# EAGLE design shield (EAGLE 7.5.0)
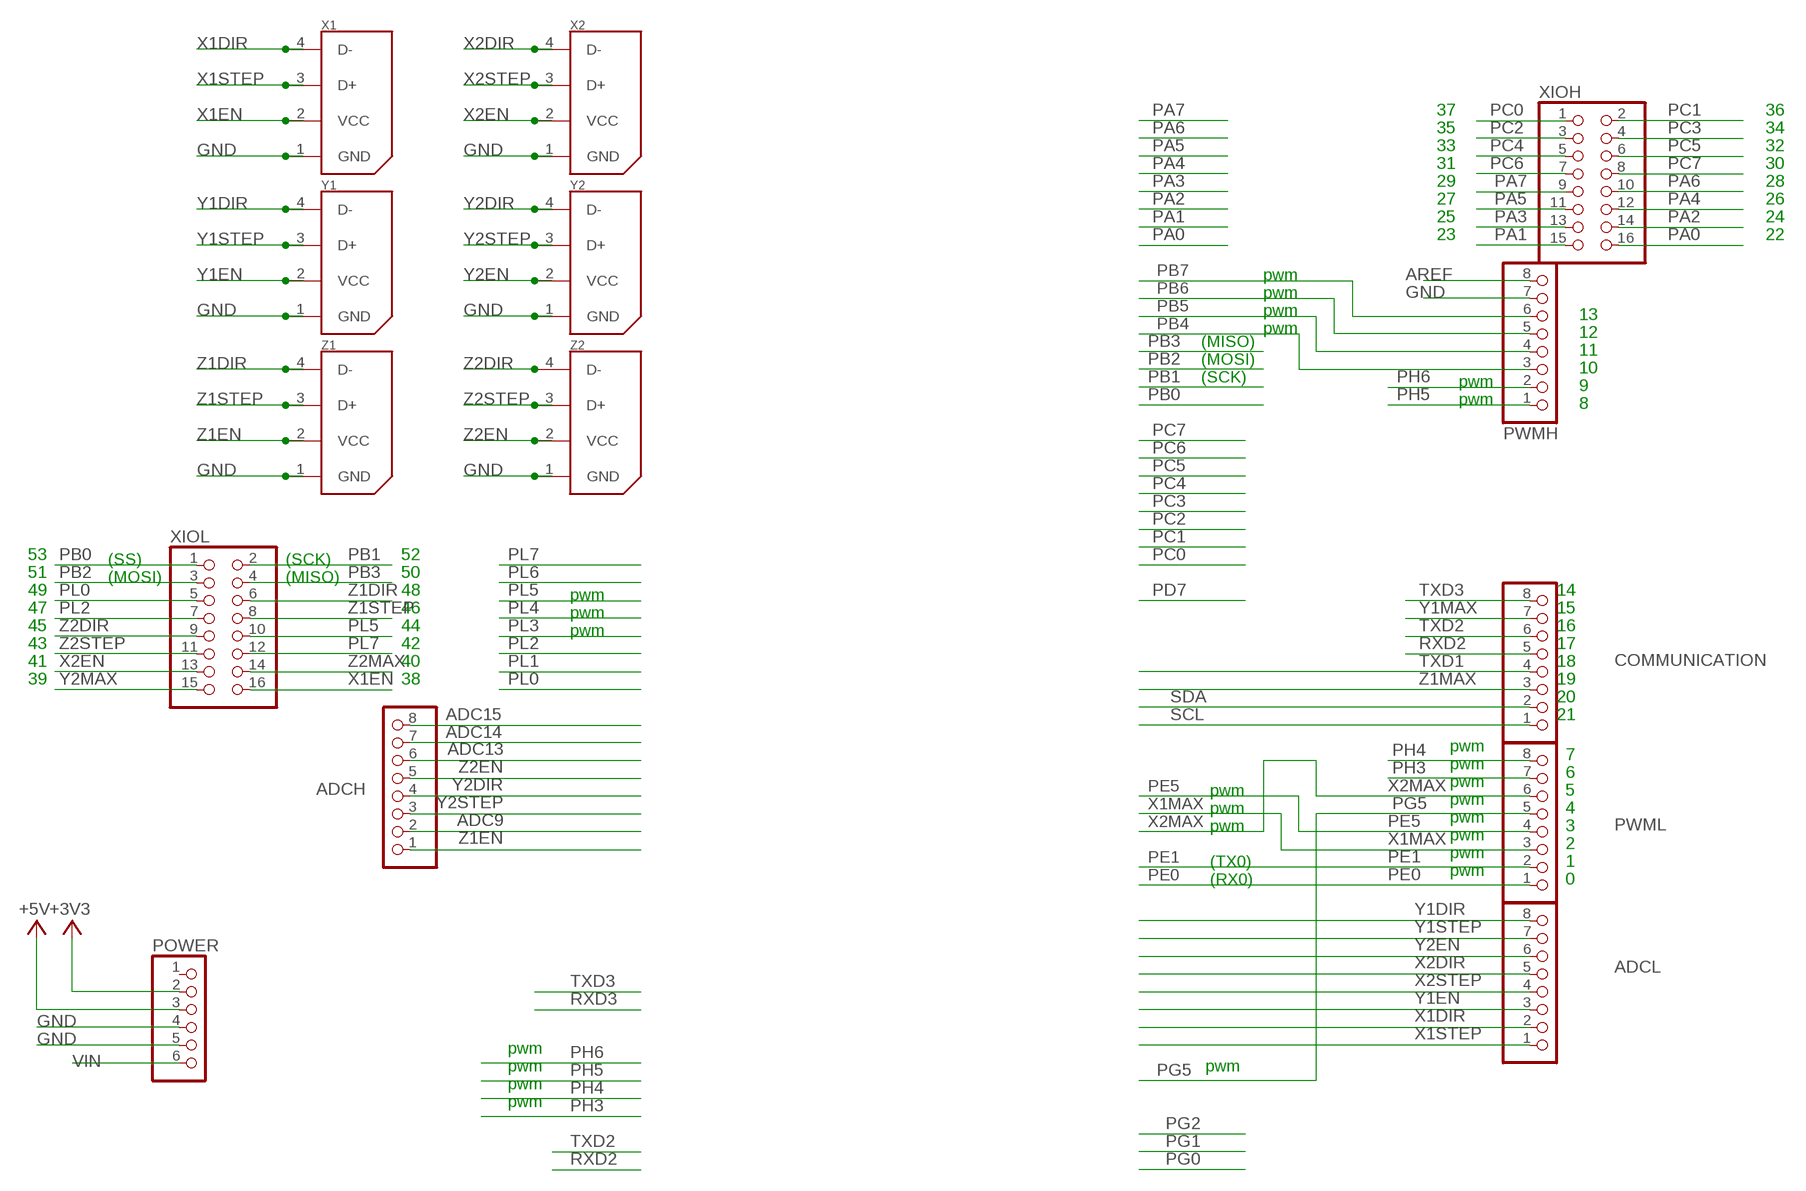
[diagram p0: schematic, sheet 1]

## Parts
ADCH  PINHD-1X8  [1X08]
ADCL  PINHD-1X8  [1X08]
COMMUNICATION  PINHD-1X8  [1X08]
POWER  PINHD-1X6  [1X06]
PWMH  PINHD-1X8  [1X08]
PWML  PINHD-1X8  [1X08]
X1  22-03-5045  [5267-4]
X2  22-03-5045  [5267-4]
XIOH  PINHD-2X8  [2X08]
XIOL  PINHD-2X8  [2X08]
Y1  22-03-5045  [5267-4]
Y2  22-03-5045  [5267-4]
Z1  22-03-5045  [5267-4]
Z2  22-03-5045  [5267-4]

## Nets
+3V3: POWER.2
+5V: POWER.3
ADC9: ADCH.2
ADC13: ADCH.6
ADC14: ADCH.7
ADC15: ADCH.8
AREF: PWMH.8
GND: POWER.4 POWER.5 PWMH.7 X1.1(GND) X2.1(GND) Y1.1(GND) Y2.1(GND) Z1.1(GND) Z2.1(GND)
PA0: XIOH.16
PA1: XIOH.15
PA2: XIOH.14
PA3: XIOH.13
PA4: XIOH.12
PA5: XIOH.11
PA6: XIOH.10
PA7: XIOH.9
PB0: XIOL.1
PB1: XIOL.2
PB2: XIOL.3
PB3: XIOL.4
PB4: PWMH.3
PB5: PWMH.4
PB6: PWMH.5
PB7: PWMH.6
PC0: XIOH.1
PC1: XIOH.2
PC2: XIOH.3
PC3: XIOH.4
PC4: XIOH.5
PC5: XIOH.6
PC6: XIOH.7
PC7: XIOH.8
PE0: PWML.1
PE1: PWML.2
PE5: PWML.4
PG5: PWML.5
PH3: PWML.7
PH4: PWML.8
PH5: PWMH.1
PH6: PWMH.2
PL0: XIOL.5
PL2: XIOL.7
PL5: XIOL.10
PL7: XIOL.12
RXD2: COMMUNICATION.5
SCL: COMMUNICATION.1
SDA: COMMUNICATION.2
TXD1: COMMUNICATION.4
TXD2: COMMUNICATION.6
TXD3: COMMUNICATION.8
VIN: POWER.6
X1DIR: ADCL.2 X1.4(D-)
X1EN: X1.2(VCC) XIOL.16
X1MAX: PWML.3
X1STEP: ADCL.1 X1.3(D+)
X2DIR: ADCL.5 X2.4(D-)
X2EN: X2.2(VCC) XIOL.13
X2MAX: PWML.6
X2STEP: ADCL.4 X2.3(D+)
Y1DIR: ADCL.8 Y1.4(D-)
Y1EN: ADCL.3 Y1.2(VCC)
Y1MAX: COMMUNICATION.7
Y1STEP: ADCL.7 Y1.3(D+)
Y2DIR: ADCH.4 Y2.4(D-)
Y2EN: ADCL.6 Y2.2(VCC)
Y2MAX: XIOL.15
Y2STEP: ADCH.3 Y2.3(D+)
Z1DIR: XIOL.6 Z1.4(D-)
Z1EN: ADCH.1 Z1.2(VCC)
Z1MAX: COMMUNICATION.3
Z1STEP: XIOL.8 Z1.3(D+)
Z2DIR: XIOL.9 Z2.4(D-)
Z2EN: ADCH.5 Z2.2(VCC)
Z2MAX: XIOL.14
Z2STEP: XIOL.11 Z2.3(D+)
Unconnected: POWER.1

## Notes on the sheet
- 37 | 36
- 35 | 34
- 33 | 32
- 31 | 30
- 29 | 28
- 27 | 26
- 25 | 24
- 23 | 22
- pwm
- pwm
- pwm | 13
- pwm | 12
- (MISO)
- 11
- (MOSI)
- 10
- (SCK) | pwm
- 9
- pwm | 8
- 53 | (SS) | (SCK) | 52
- 51 | (MOSI) | (MISO) | 50
- 49 | 48 | pwm | 14
- 47 | 46 | pwm | 15
- 45 | 44 | pwm | 16
- 43 | 42 | 17
- 41 | 40 | 18
- 39 | 38 | 19
- 20
- 21
- pwm
- 7
- pwm
- 6
- pwm
- pwm | 5
- pwm
- pwm | 4
- pwm
- pwm | 3
- pwm
- 2
- pwm
- (TX0) | 1
- pwm
- (RX0) | 0
- pwm
- pwm | pwm
- pwm
- pwm

## Library data of the parts
ADCH ADCL COMMUNICATION PWMH PWML = pinhead:PINHD-1X8: PIN HEADER
POWER = pinhead:PINHD-1X6: PIN HEADER
X1 X2 Y1 Y2 Z1 Z2 = molex:22-03-5045: Molex SPOX Vert, Tin (Dynamixel RX Bus) tested: YES (arbotix2)
XIOH XIOL = pinhead:PINHD-2X8: PIN HEADER

## Net classes
0 default: width 0.152 mm, drill 0.305 mm, clearance 0.152 mm

## Board
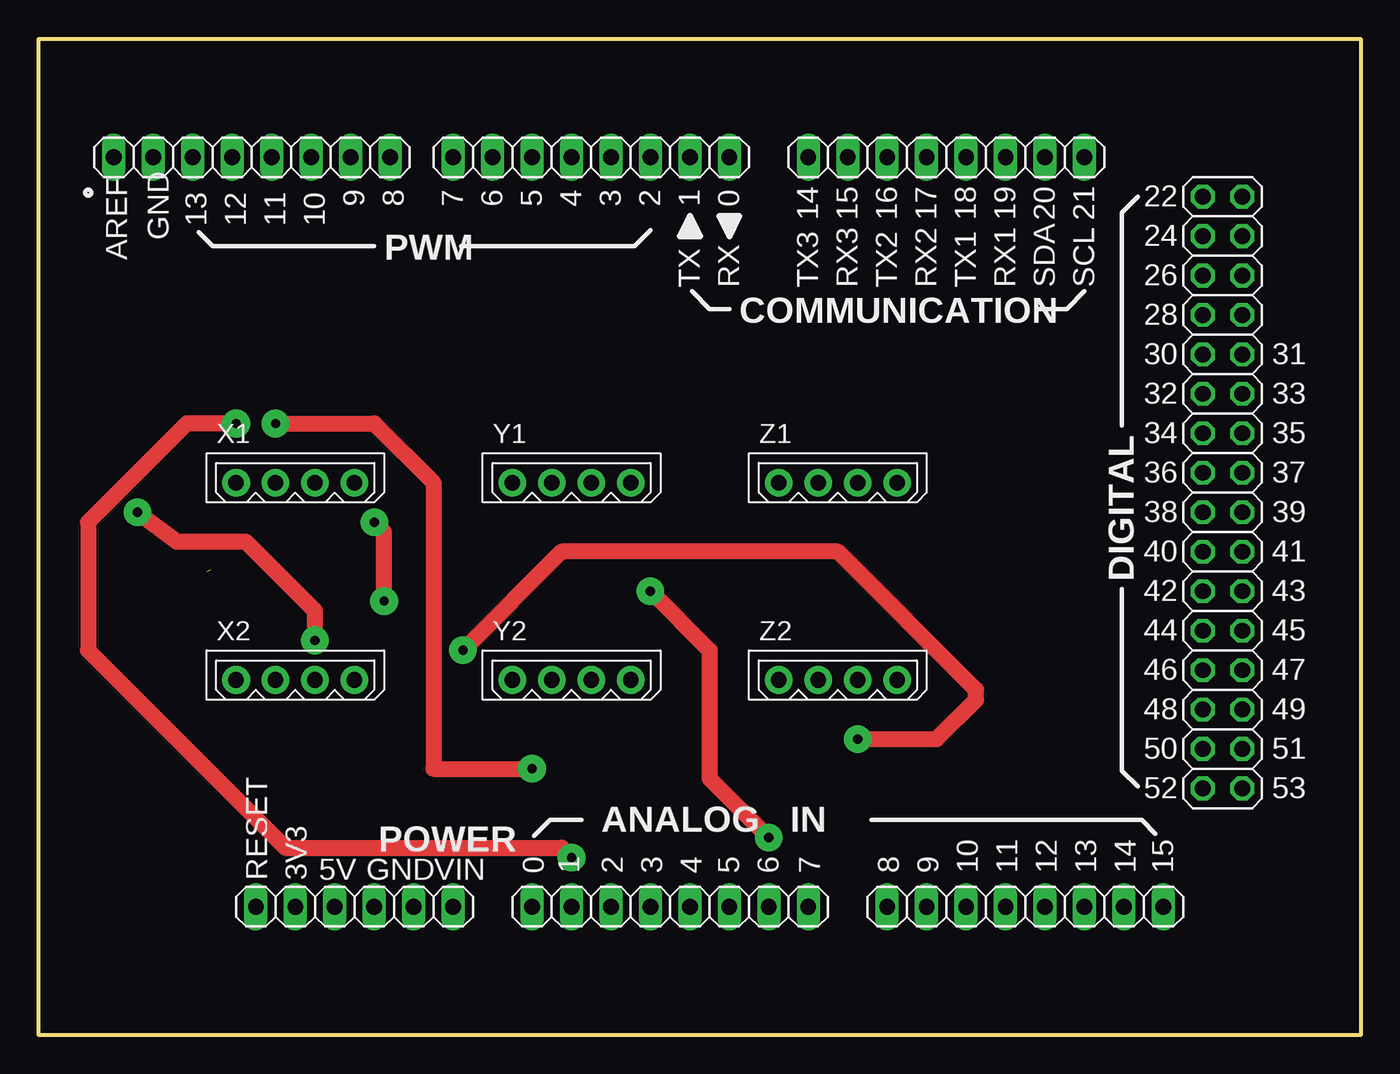
[diagram p1: board, top side]
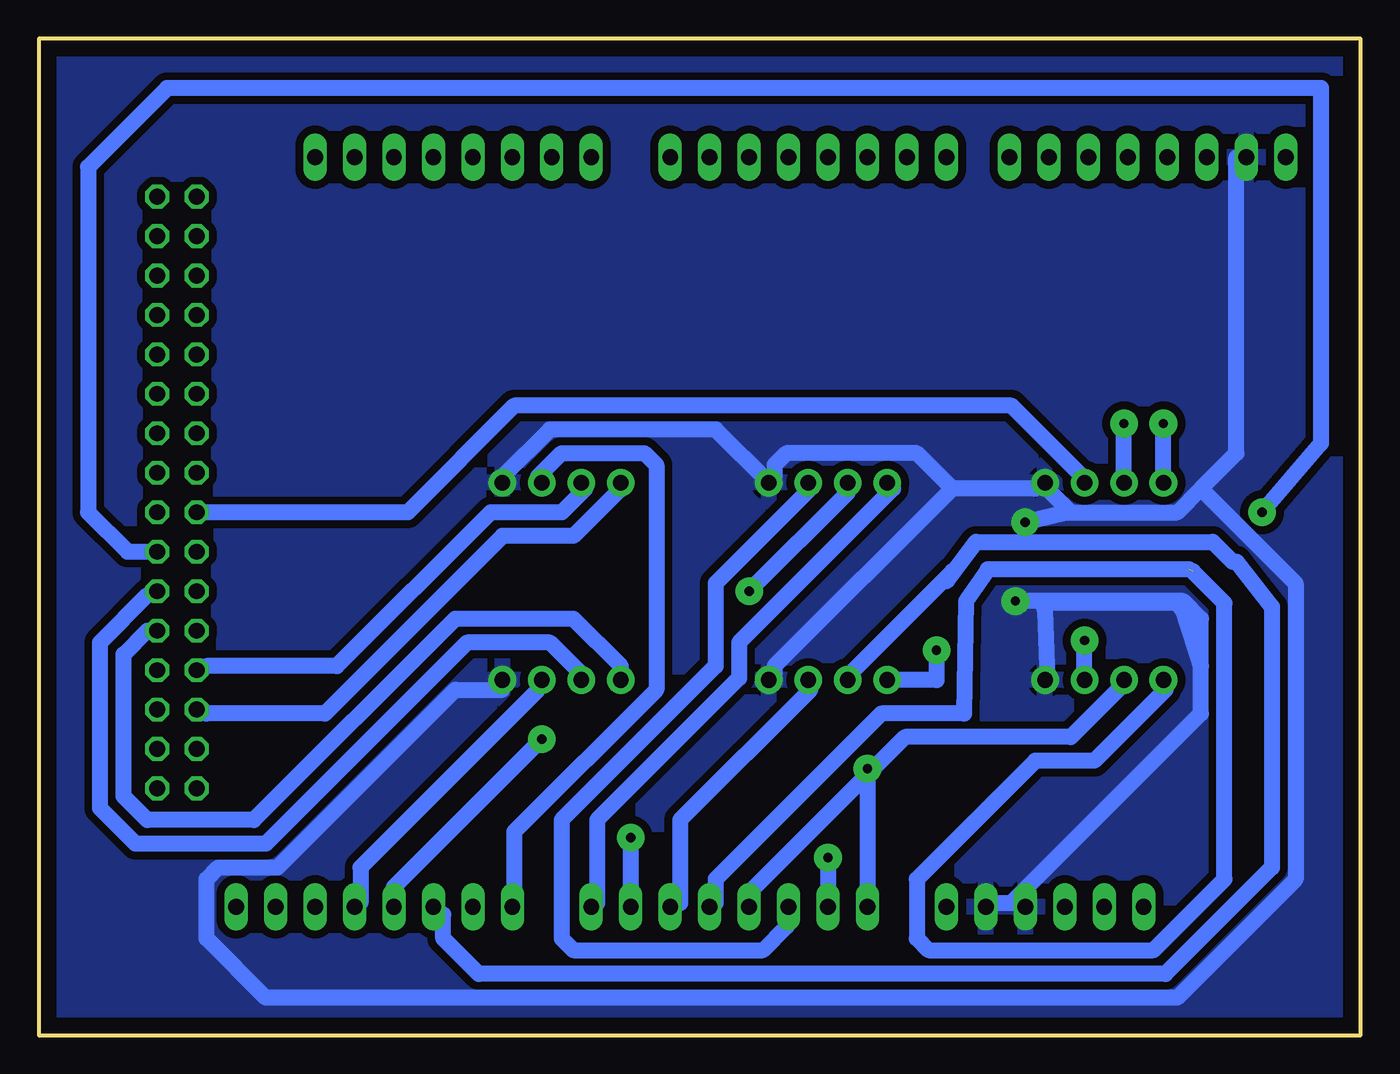
[diagram p2: board, bottom side, seen from below]

Size 85.09 x 64.14 mm. Coordinates in mm from the lower left corner, seen from the top.
Outline: 0,64.14 85.09,64.14 85.09,0 0,0 0,64.14
Copper layers (1*16): Top 0.035mm / dielectric 1.5mm / Bottom 0.035mm
Design rules "default *": minimum track width 40mil, minimum drill 12mil, track to track 20mil, track to pad 20mil, pad to pad 20mil, via to via 20mil, smd to smd 20mil, copper to edge 40mil, drill to drill 12mil, minimum pad ring 10mil, minimum via ring 10mil, stop-mask expansion 2mil, vias tented up to drill 1mil, thermal gap 10mil

### Footprints (pad centres in the part's own frame; a part is rotated, then mirrored left to right if it is on the bottom)
1X08 = drill 1.016 long: 1 -8.89,0; 2 -6.35,0; 3 -3.81,0; 4 -1.27,0; 5 1.27,0; 6 3.81,0; 7 6.35,0; 8 8.89,0
1X06 = drill 1.016 long: 1 -6.35,0; 2 -3.81,0; 3 -1.27,0; 4 1.27,0; 5 3.81,0; 6 6.35,0
5267-4 = drill 1 pad 1.778: 1 0,0; 2 -2.54,0; 3 -5.08,0; 4 -7.62,0
2X08 = drill 1.016 octagon: 1 -8.89,-1.27; 2 -8.89,1.27; 3 -6.35,-1.27; 4 -6.35,1.27; 5 -3.81,-1.27; 6 -3.81,1.27; 7 -1.27,-1.27; 8 -1.27,1.27; 9 1.27,-1.27; 10 1.27,1.27; 11 3.81,-1.27; 12 3.81,1.27; 13 6.35,-1.27; 14 6.35,1.27; 15 8.89,-1.27; 16 8.89,1.27

### Placement (x,y rotation side)
ADCH  63.5,8.26 0 top
ADCL  40.64,8.26 0 top
COMMUNICATION  58.42,56.51 180 top
POWER  20.32,8.26 0 top
PWMH  13.72,56.51 180 top
PWML  35.56,56.51 180 top
X1  20.32,35.56 0 top
X2  20.32,22.86 0 top
XIOH  76.2,45.08 90 top
XIOL  76.2,24.77 90 top
Y1  38.1,35.56 0 top
Y2  38.1,22.86 0 top
Z1  55.25,35.56 0 top
Z2  55.25,22.86 0 top

### Tracks (layer width: path | path; a pad name or v marks a point on that pad's centre or on a via)
GND  (via drill 0.6 pad 1.78)
  Top 1.016: v22.22,27.94 22.22,32.38 v21.59,33.02
  Bottom 1.016: 22.48,8.51 24,8.51 POWER.5 | 22.48,8.51 21.72,8.51 POWER.4 | 11.81,27.81 20.45,27.81 20.32,27.3 20.19,23.75 20.19,22.99 X2.1 | 10.29,23.75 11.43,27.3 | 11.81,27.81 11.43,27.3 | 11.43,27.3 11.18,26.92 11.81,27.81 | 10.29,23.75 10.29,20.7 22.48,8.51 | 10.29,35.18 11.81,33.65 18.67,33.65 | 10.29,35.18 8,37.46 8,56.51 PWMH.7 | 18.67,33.65 20.19,35.18 X1.1 20.95,35.18 26.29,35.18 | 26.29,35.18 37.72,23.75 37.72,22.99 Y2.1 | 10.29,35.18 4.19,29.08 4.19,10.03 11.81,2.41 70.48,2.41 74.3,6.22 74.3,10.03 73.53,10.79 69.72,10.79 58.29,22.23 55.25,22.23 Z2.1 | 26.29,35.18 28.57,37.46 36.96,37.46 37.72,36.7 37.72,35.94 Y1.1 41.53,38.99 52.2,38.99 55.25,35.94 Z1.1 | 10.29,23.75 10.29,26.8 11.43,27.94 v22.22,27.94 | v21.59,33.02 19.05,33.65 18.67,33.65
  pour Bottom: -0.64,0 85.09,0 85.09,64.14 -0.64,64.14
X1DIR  (via drill 0.6 pad 1.78)
  Top 1.016: v12.7,39.37 9.53,39.37 3.17,33.02 3.17,24.77 15.88,12.07 33.66,12.07 v34.29,11.43
  Bottom 1.016: X1.4 v12.7,39.37 | v34.29,11.43 ADCL.2
X1EN
  Bottom 1.016: XIOL.16 61.34,33.65 54.48,40.51 22.48,40.51 17.91,35.94 X1.2
X1STEP  (via drill 0.6 pad 1.78)
  Top 1.016: v15.24,39.37 21.59,39.37 25.4,35.56 25.4,17.14 v31.75,17.14
  Bottom 1.016: X1.3 v15.24,39.37 | v31.75,17.14 ADCL.1
X2DIR  (1 unrouted)
  Bottom 1.016: 11.05,29.97 24,29.97 25.4,27.94 25.53,20.7 30.86,20.7 41.53,10.03 41.53,8.51 ADCL.5 | 10.79,29.84 8.76,27.81 8.76,10.03 13.34,5.46 27.81,5.46 28.57,6.22 28.57,10.03 20.95,17.65 17.14,17.65 12.57,22.23 X2.4
X2EN  (via drill 0.6 pad 1.78)
  Top 1.016: v17.78,25.4 17.78,27.3 13.34,31.75 8.89,31.75 v6.35,33.65
  Bottom 1.016: X2.2 v17.78,25.4 | v6.35,33.65 2.54,38.1 2.54,60.96 76.83,60.96 81.91,55.88 81.91,33.65 79.38,31.11 XIOL.13
X2STEP
  Bottom 1.016: ADCL.4 39.24,8.51 39.24,9.27 29.34,19.18 18.67,19.18 15.62,22.23 X2.3
Y1DIR
  Bottom 1.016: ADCL.8 49.15,8.51 49.15,13.84 40.01,22.99 40.01,25.27 30.1,35.18 Y1.4
Y1EN
  Bottom 1.016: ADCL.3 36.96,7.75 36.96,6.99 38.48,5.46 50.67,5.46 51.44,6.22 51.44,13.84 41.53,23.75 41.53,29.08 35.43,35.18 Y1.2
Y1STEP  (via drill 0.6 pad 1.78)
  Top 1.016: v39.37,28.57 43.18,24.77 43.18,16.51 v46.99,12.7
  Bottom 1.016: Y1.3 33.02,34.92 v39.37,28.57 | v46.99,12.7 ADCL.7
Y2DIR  (via drill 0.6 pad 1.78)
  Top 1.016: v52.71,19.05 57.79,19.05 60.33,21.59 60.33,22.23 51.44,31.11 33.66,31.11 v27.3,24.77
  Bottom 1.016: ADCH.4 62.23,9.53 v52.71,19.05 | v27.3,24.77 27.3,22.86 Y2.4
Y2EN
  Bottom 1.016: ADCL.6 43.82,8.51 43.82,13.84 35.43,22.23 Y2.2
Y2STEP
  Bottom 1.016: ADCH.3 59.05,7.75 59.05,6.22 56.77,3.94 12.57,3.94 5.71,10.79 5.71,27.56 8,30.48 8.26,30.48 9.53,31.75 24.76,31.75 26.67,29.21 26.29,29.84 33.15,22.99 Y2.3
Z1DIR
  Bottom 1.016: XIOL.6 74.3,20.7 66.67,20.7 55.25,32.13 50.67,32.13 47.62,35.18 Z1.4
Z1EN
  Bottom 1.016: ADCH.1 54.48,8.51 54.48,13.08 45.34,22.23 45.34,36.7 46.1,37.46 51.44,37.46 52.96,35.94 Z1.2
Z1STEP
  Bottom 1.016: XIOL.8 74.3,23.75 65.91,23.75 56.01,33.65 51.44,33.65 49.91,35.18 Z1.3
Z2DIR
  Bottom 1.016: Z2.4 47.62,23.75 50.67,26.8 58.29,26.8 71.25,13.84 78.1,13.84 79.63,15.37 79.63,24.51 78.1,26.04 XIOL.9
Z2EN
  Bottom 1.016: ADCH.5 64.39,8.51 64.39,10.79 52.96,22.23 Z2.2
Z2STEP
  Bottom 1.016: XIOL.11 78.1,28.32 81.15,25.27 81.15,14.61 78.87,12.32 70.48,12.32 57.53,25.27 52.2,25.27 49.91,22.99 Z2.3

### Text on the board
tPlace: 9 | 8 | 7 | 6 | 5 | 4 | 3 | 2 | 1 | 0 | 22 | 14 | 15 | 16 | 17 | 18 | 19 | 20 | 21 | 13 | 12 | 11 | 10 | 24 | 26 | 28 | 30 | 31 | 32 | 33 | 34 | 35 | 36 | 37 | 38 | 39 | 40 | 41 | 42 | 43 | 44 | 45 | 46 | 47 | 48 | 49 | 50 | 51 | 52 | 53 | 0 | 1 | 2 | 3 | 4 | 5 | 6 | 7 | 8 | 9 | 10 | 11 | 12 | 13 | 14 | 15
tNames: GND | AREF | PWM | TX | RX | TX3 | RX3 | TX2 | RX2 | TX1 | RX1 | SDA | SCL | DIGITAL | ANALOG IN | RESET | 3V3 | 5V | GND | VIN